# Altium project CW308T_STM32F415.PrjPcb
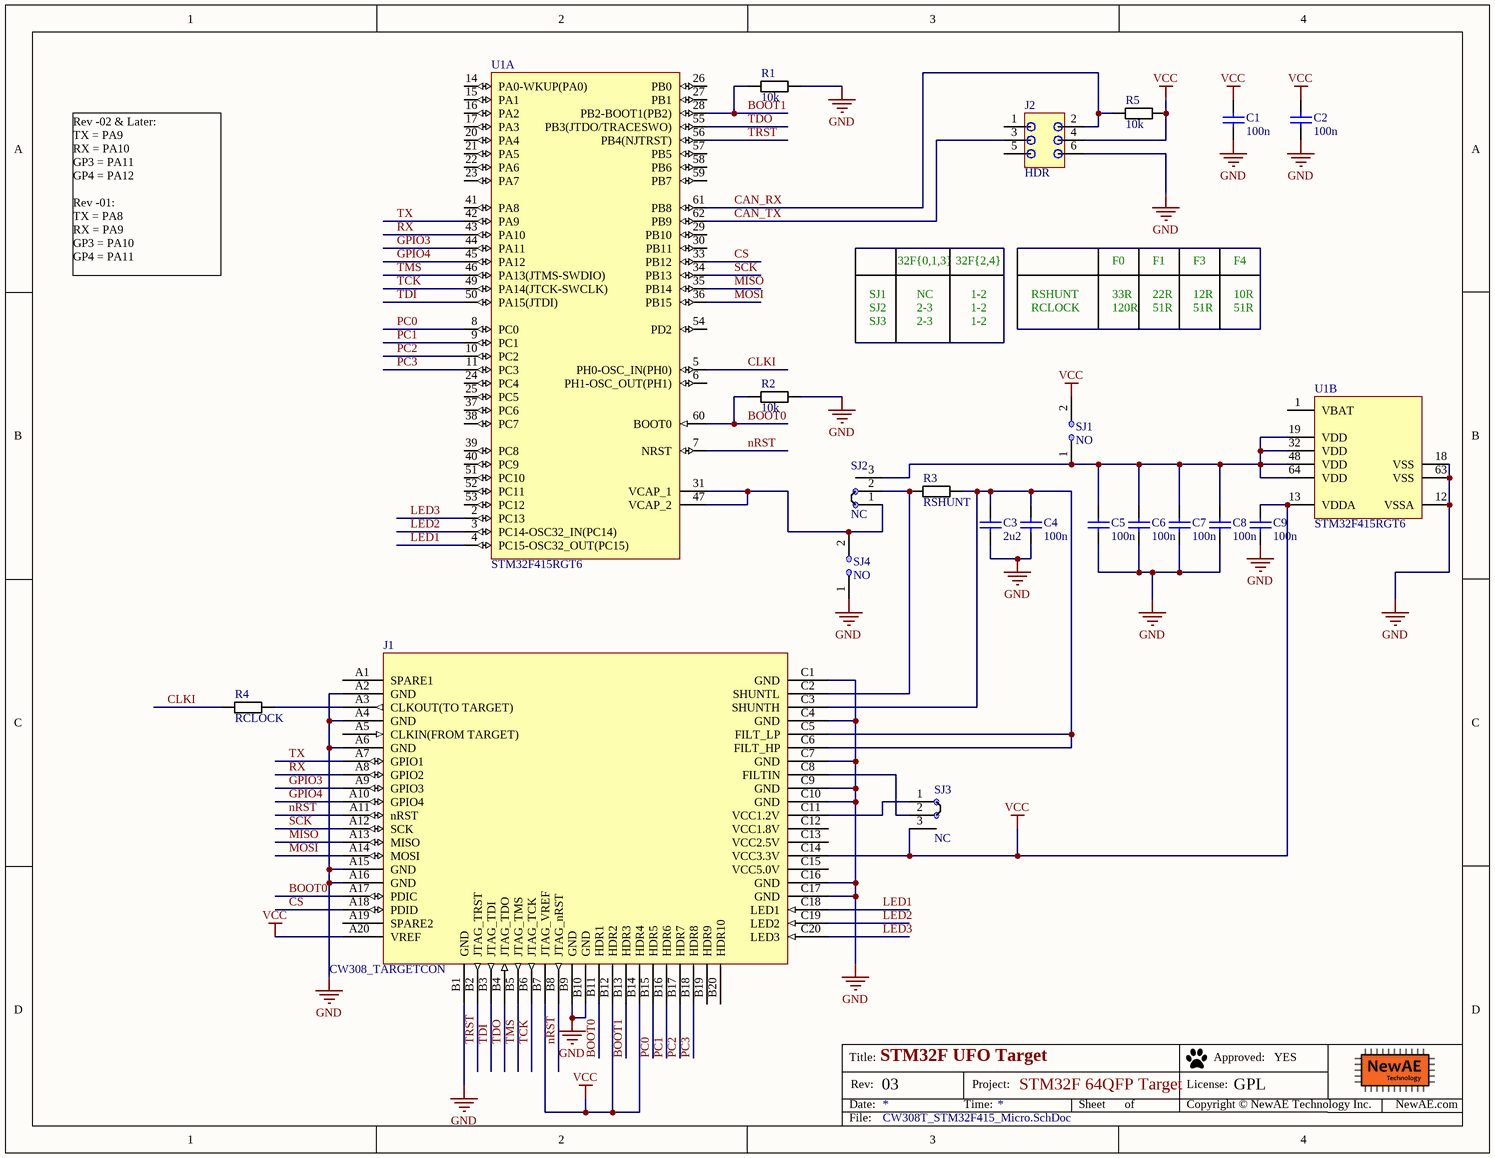
[diagram p0: CW308T_STM32F415_Micro.SchDoc]
PrjLicense: GPL; PrjName: STM32F 64QFP Target; PrjRev: 03
1 sheet, 21 parts. Net scope: global (net labels, ports and power ports of the same name join across sheets).
Board files: CW308T_STM32F415.PcbDoc, CW308T_STM32415_PANEL.PcbDoc

## Sheet CW308T_STM32F415_Micro.SchDoc: STM32F UFO Target
size Letter; Organization: NewAE Technology Inc.; Address1: 1083 Queen St., Suite 196; Address2: Halifax; Address3: NS; Address4: Canada B3H 0B2; SheetApproved: YES

### Parts
C1  100n  [CAPC0603_M]
C2  100n  [CAPC0603_M]
C3  2u2  [CAPC0603_M]
C4  100n  [CAPC0603_M]
C5  100n  [CAPC0603_M]
C6  100n  [CAPC0603_M]
C7  100n  [CAPC0603_M]
C8  100n  [CAPC0603_M]
C9  100n  [CAPC0603_M]
J1  CW308_TARGETCON  [CW308_TBOARD_CONN]
J2  HDR  [HDR_6PIN_2ROW_SHROUD]
R1  10k  [RESC1608X55N]
R2  10k  [RESC1608X55N]
R3  RSHUNT  [RESC1608X55N]
R4  RCLOCK  [RESC1608X55N]
R5  10k  [RESC1608X55N]
SJ1  NO  [SJ_2S_NO]  (no BOM)
SJ2  NC  [SJ_3S_NC12]  (no BOM)
SJ3  NC  [SJ_3S_NC12]  (no BOM)
SJ4  NO  [SJ_2S_NO]  (no BOM)
U1  STM32F415RGT6  [STM-LQFP64_V]  (parts A,B of 2)

### Nets
GND: C1.2 C2.2 C3.2 C4.2 C5.2 C6.2 C7.2 C8.2 C9.2 J1.A2(GND) J1.A4(GND) J1.A6(GND) J1.A15(GND) J1.A16(GND) J1.B1(GND) J1.B9(GND) J1.B10(GND) J1.C1(GND) J1.C4(GND) J1.C7(GND) J1.C9(GND) J1.C10(GND) J1.C16(GND) J1.C17(GND) J2.6 R1.2 R2.2 SJ4.1 U1.12(VSSA) U1.18(VSS) U1.63(VSS)
VCC: C1.1 C2.1 C9.1 J1.A20(VREF) J1.B7(JTAG_VREF) J1.B12(HDR2) J1.B14(HDR4) J1.C14(VCC3.3V) J2.4 R5.2 SJ1.2 SJ3.3 U1.13(VDDA)
BOOT0: J1.A17(PDIC) J1.B11(HDR1) R2.1 U1.60(BOOT0)
BOOT1: J1.B13(HDR3) R1.1 U1.28(PB2-BOOT1(PB2))
CAN_RX: J2.2 R5.1 U1.61(PB8)
CAN_TX: J2.3 U1.62(PB9)
CLKI: R4.1 U1.5(PH0-OSC_IN(PH0))
CS: J1.A18(PDID) U1.33(PB12)
GPIO3: J1.A9(GPIO3) U1.44(PA11)
GPIO4: J1.A10(GPIO4) U1.45(PA12)
LED1: J1.C18(LED1) U1.4(PC15-OSC32_OUT(PC15))
LED2: J1.C19(LED2) U1.3(PC14-OSC32_IN(PC14))
LED3: J1.C20(LED3) U1.2(PC13)
MISO: J1.A13(MISO) U1.35(PB14)
MOSI: J1.A14(MOSI) U1.36(PB15)
nRST: J1.A11(nRST) J1.B8(JTAG_nRST) U1.7(NRST)
PC0: J1.B15(HDR5) U1.8(PC0)
PC1: J1.B16(HDR6) U1.9(PC1)
PC2: J1.B17(HDR7) U1.10(PC2)
PC3: J1.B18(HDR8) U1.11(PC3)
RX: J1.A8(GPIO2) U1.43(PA10)
SCK: J1.A12(SCK) U1.34(PB13)
TCK: J1.B6(JTAG_TCK) U1.49(PA14(JTCK-SWCLK))
TDI: J1.B3(JTAG_TDI) U1.50(PA15(JTDI))
TDO: J1.B4(JTAG_TDO) U1.55(PB3(JTDO/TRACESWO))
TMS: J1.B5(JTAG_TMS) U1.46(PA13(JTMS-SWDIO))
TRST: J1.B2(JTAG_TRST) U1.56(PB4(NJTRST))
TX: J1.A7(GPIO1) U1.42(PA9)
NetC3_1: C3.1 C4.1 J1.C3(SHUNTH) J1.C5(FILT_LP) J1.C6(FILT_HP) R3.2
NetC5_1: C5.1 C6.1 C7.1 C8.1 SJ1.1 SJ2.3 U1.19(VDD) U1.32(VDD) U1.48(VDD) U1.64(VDD)
NetJ1_A3: J1.A3(CLKOUT(TO_TARGET)) R4.2
NetJ1_C2: J1.C2(SHUNTL) R3.1 SJ2.2
NetJ1_C8: J1.C8(FILTIN) SJ3.2
NetJ1_C11: J1.C11(VCC1.2V) SJ3.1
NetSJ2_1: SJ2.1 SJ4.2 U1.31(VCAP_1) U1.47(VCAP_2)

Not connected (* = marked no-connect by the designer): J1 A1(SPARE1) A5(CLKIN(FROM_TARGET)) A19(SPARE2) B19(HDR9) B20(HDR10) C12(VCC1.8V) C13(VCC2.5V) C15(VCC5.0V); J2 1 5; U1 1(VBAT) 6(PH1-OSC_OUT(PH1)) 14(PA0-WKUP(PA0)) 15(PA1) 16(PA2) 17(PA3) 20(PA4) 21(PA5) 22(PA6) 23(PA7) 24(PC4) 25(PC5) 26(PB0) 27(PB1) 29(PB10) 30(PB11) 37(PC6) 38(PC7) 39(PC8) 40(PC9) 41(PA8) 51(PC10) 52(PC11) 53(PC12) 54(PD2) 57(PB5) 58(PB6) 59(PB7)

### Notes on the sheet
- Rev -02 & Later:
  TX = PA9
  RX = PA10
  GP3 = PA11
  GP4 = PA12
  Rev -01:
  TX = PA8
  RX = PA9
  GP3 = PA10
  GP4 = PA11
- SJ1
- 32F{0,1,3}
- NC
- 32F{2,4}
- 1-2
- RSHUNT
- F0
- 33R
- 22R
- F1
- 12R
- F3
- 10R
- F4
- SJ2
- SJ3
- 2-3
- RCLOCK
- 120R
- 51R
- Title:
- Date:
- Rev:
- Time:
- Project:
- Sheet
- of
- License:
- Copyright © NewAE Technology Inc.
- Approved:
- NewAE.com
- File:

### Library data of the parts
C1 C2 C4-C9 = CCHIP-100n-0603: 100n, 0603; Component Group: Capacitor; Case-EIA: 0603; Case-Metric: 1608; Part Number: CCHIP-100n-0603; Footprint: 0603; Pin Count: 2; Value: 100n; Mounting Technology: SMT; Component Kind: Standard; Component Type: Standard
C3 = CCHIP-2u2-0603: 2u2, 0603; Component Group: Capacitor; Case-EIA: 0603; Case-Metric: 1608; Part Number: CCHIP-2u2-0603; Footprint: 0603; Pin Count: 2; Value: 2u2; Mounting Technology: SMT; Component Kind: Standard; Component Type: Standard
J1 = CW308_TBOARD: CW308 "Standard" Target Board Connector; Component Group: Mechanical; Pitch: 2.54mm; Part Number: CW308_TBOARD; Pin Count: 60; Mounting Technology: Through-hole; Component Kind: Standard; Component Type: Standard
J2 = HDR_6PIN_2ROW_SHROUD: HDR, Male, 6-Pin, 2 Row, Shrouded; Manufacture 1: FCI Connectors; Manufacture Part Number 1: 75869-131LF; Component Group: Connector; Part Number: HDR_6PIN_2ROW_SHROUD; Pin Count: 6; Supplier 1: Digi-Key; Supplier Part Number 1: 609-2845-ND; Mounting Technology: Through-hole; RoHS: Yes; Component Kind: Standard; Component Type: Standard
R1 R2 R5 = RCHIP-10K-0603: 10k res, 0603, 1%, 1/10W; Manufacture 1: Yageo; Manufacture Part Number 1: RC0603FR-0710KL; Component Group: Resistor; Case-EIA: 0603; Case-Metric: 1608; Rated Power: 0.1W; Rated Voltage: 75VDC; Part Number: RCHIP-10K-0603; Footprint: 0603; Pin Count: 2; Supplier 1: Digi-Key; Supplier Part Number 1: 311-10.0KHRCT-ND; Value: 10k; Tolerance: 1%; Mounting Technology: SMT; Temperature Range: -55C to 155C; Component Kind: Standard; Component Type: Standard
R3 = RCHIP-10R-0603: 10R res, 0603, 1%, 1/10W; Manufacture 1: Yageo; Manufacture Part Number 1: RC0603FR-0710RL; Component Group: Resistor; Case-EIA: 0603; Case-Metric: 1608; Rated Power: 0.1W; Rated Voltage: 75VDC; Part Number: RCHIP-10R-0603; Footprint: 0603; Pin Count: 2; Supplier 1: Digi-Key; Supplier Part Number 1: 311-10.0HRCT-ND; Value: 10R; Tolerance: 1%; Mounting Technology: SMT; Temperature Range: -55C to 155C; Component Kind: Standard; Component Type: Standard
R4 = RCHIP-100R-0603: 100R res, 0603, 1%, 1/10W; Manufacture 1: Yageo; Manufacture Part Number 1: RC0603FR-07100RL; Component Group: Resistor; Case-EIA: 0603; Case-Metric: 1608; Rated Power: 0.1W; Rated Voltage: 75VDC; Part Number: RCHIP-100R-0603; Footprint: 0603; Pin Count: 2; Supplier 1: Digi-Key; Supplier Part Number 1: 311-100HRCT-ND; Value: 100R; Tolerance: 1%; Mounting Technology: SMT; Temperature Range: -55C to 155C; Component Kind: Standard; Component Type: Standard
SJ1 SJ4 = SJ_2S_NO: Solder Jumper, NO; Component Group: PCB Feature; Part Number: SJ_2S_NO; Pin Count: 2; Mounting Technology: COPPER; Component Type: Standard (No BOM)
SJ2 SJ3 = SJ_3S_12JMP: Solder Jumper, NC; Component Group: PCB Feature; Part Number: SJ_3S_12JMP; Pin Count: 3; Mounting Technology: COPPER; Component Type: Standard (No BOM)
U1 = CMP-0243-00023-3: ARM Cortex-M4 32-bit MCU+FPU, 210 DMIPS, 1024 kB Flash, 192 kB Internal RAM, 51 I/Os, 64-pin LQFP, -40 to 85 degC, Tray; Manufacturer: STMicroelectronics; FLASH Size (Prog) (kB): 1024; Supply Voltage(Vcc) max (V): 3.6; Operating Frequency(F) (Processor speed) (MHz): 168; D/A Converter: 2x12-bit; Supply Voltage(Vcc) min (V): 1.8; Internal RAM Size (kB): 192; I/Os (High Current): 51; PackageReference: LQFP64; ComponentLink1Description: Manufacturer URL; ComponentLink1URL: http://www.st.com/web/en/home.html; ComponentLink2URL: http://www.st.com/st-web-ui/static/active/en/resource/technical/document/datasheet/DM00035129.pdf; PartNumber: STM32F415RGT6; Packing: Tray; Core: ARM Cortex-M4; ComponentLink3Description: Package Specification; PackageDescription: 64-Pin Low Profile Quad Flat Package, 10 x 10 mm Body, 0.5 mm Pitch; Mounting Technology: Surface Mount; ComponentLink3URL: http://www.st.com/st-web-ui/static/active/en/resource/technical/document/datasheet/DM00037051.pdf; PackageVersion: Rev. 4, 06/2013; ComponentLink2Description: Datasheet; DatasheetVersion: Rev. 4; PartId: 1